# Altium schematic sheet IQDemod.SchDoc: Top Level
size 431 x 279 mm; Author: Kevin Heyer; DrawnBy: Kevin Heyer; Organization: ORGANIZATION; Address1: 207; Address2: 13399 104 Ave; Address3: Surrey BC, V3T 0C9; Address4: Canada; Revision: V0.0.0; SheetNumber: 1; SheetTotal: 2; Project: IQ Demod; ENG_APP_DATE: --/--/--; DSN_APP_DATE: --/--/--; CHK_APP_DATE: --/--/--
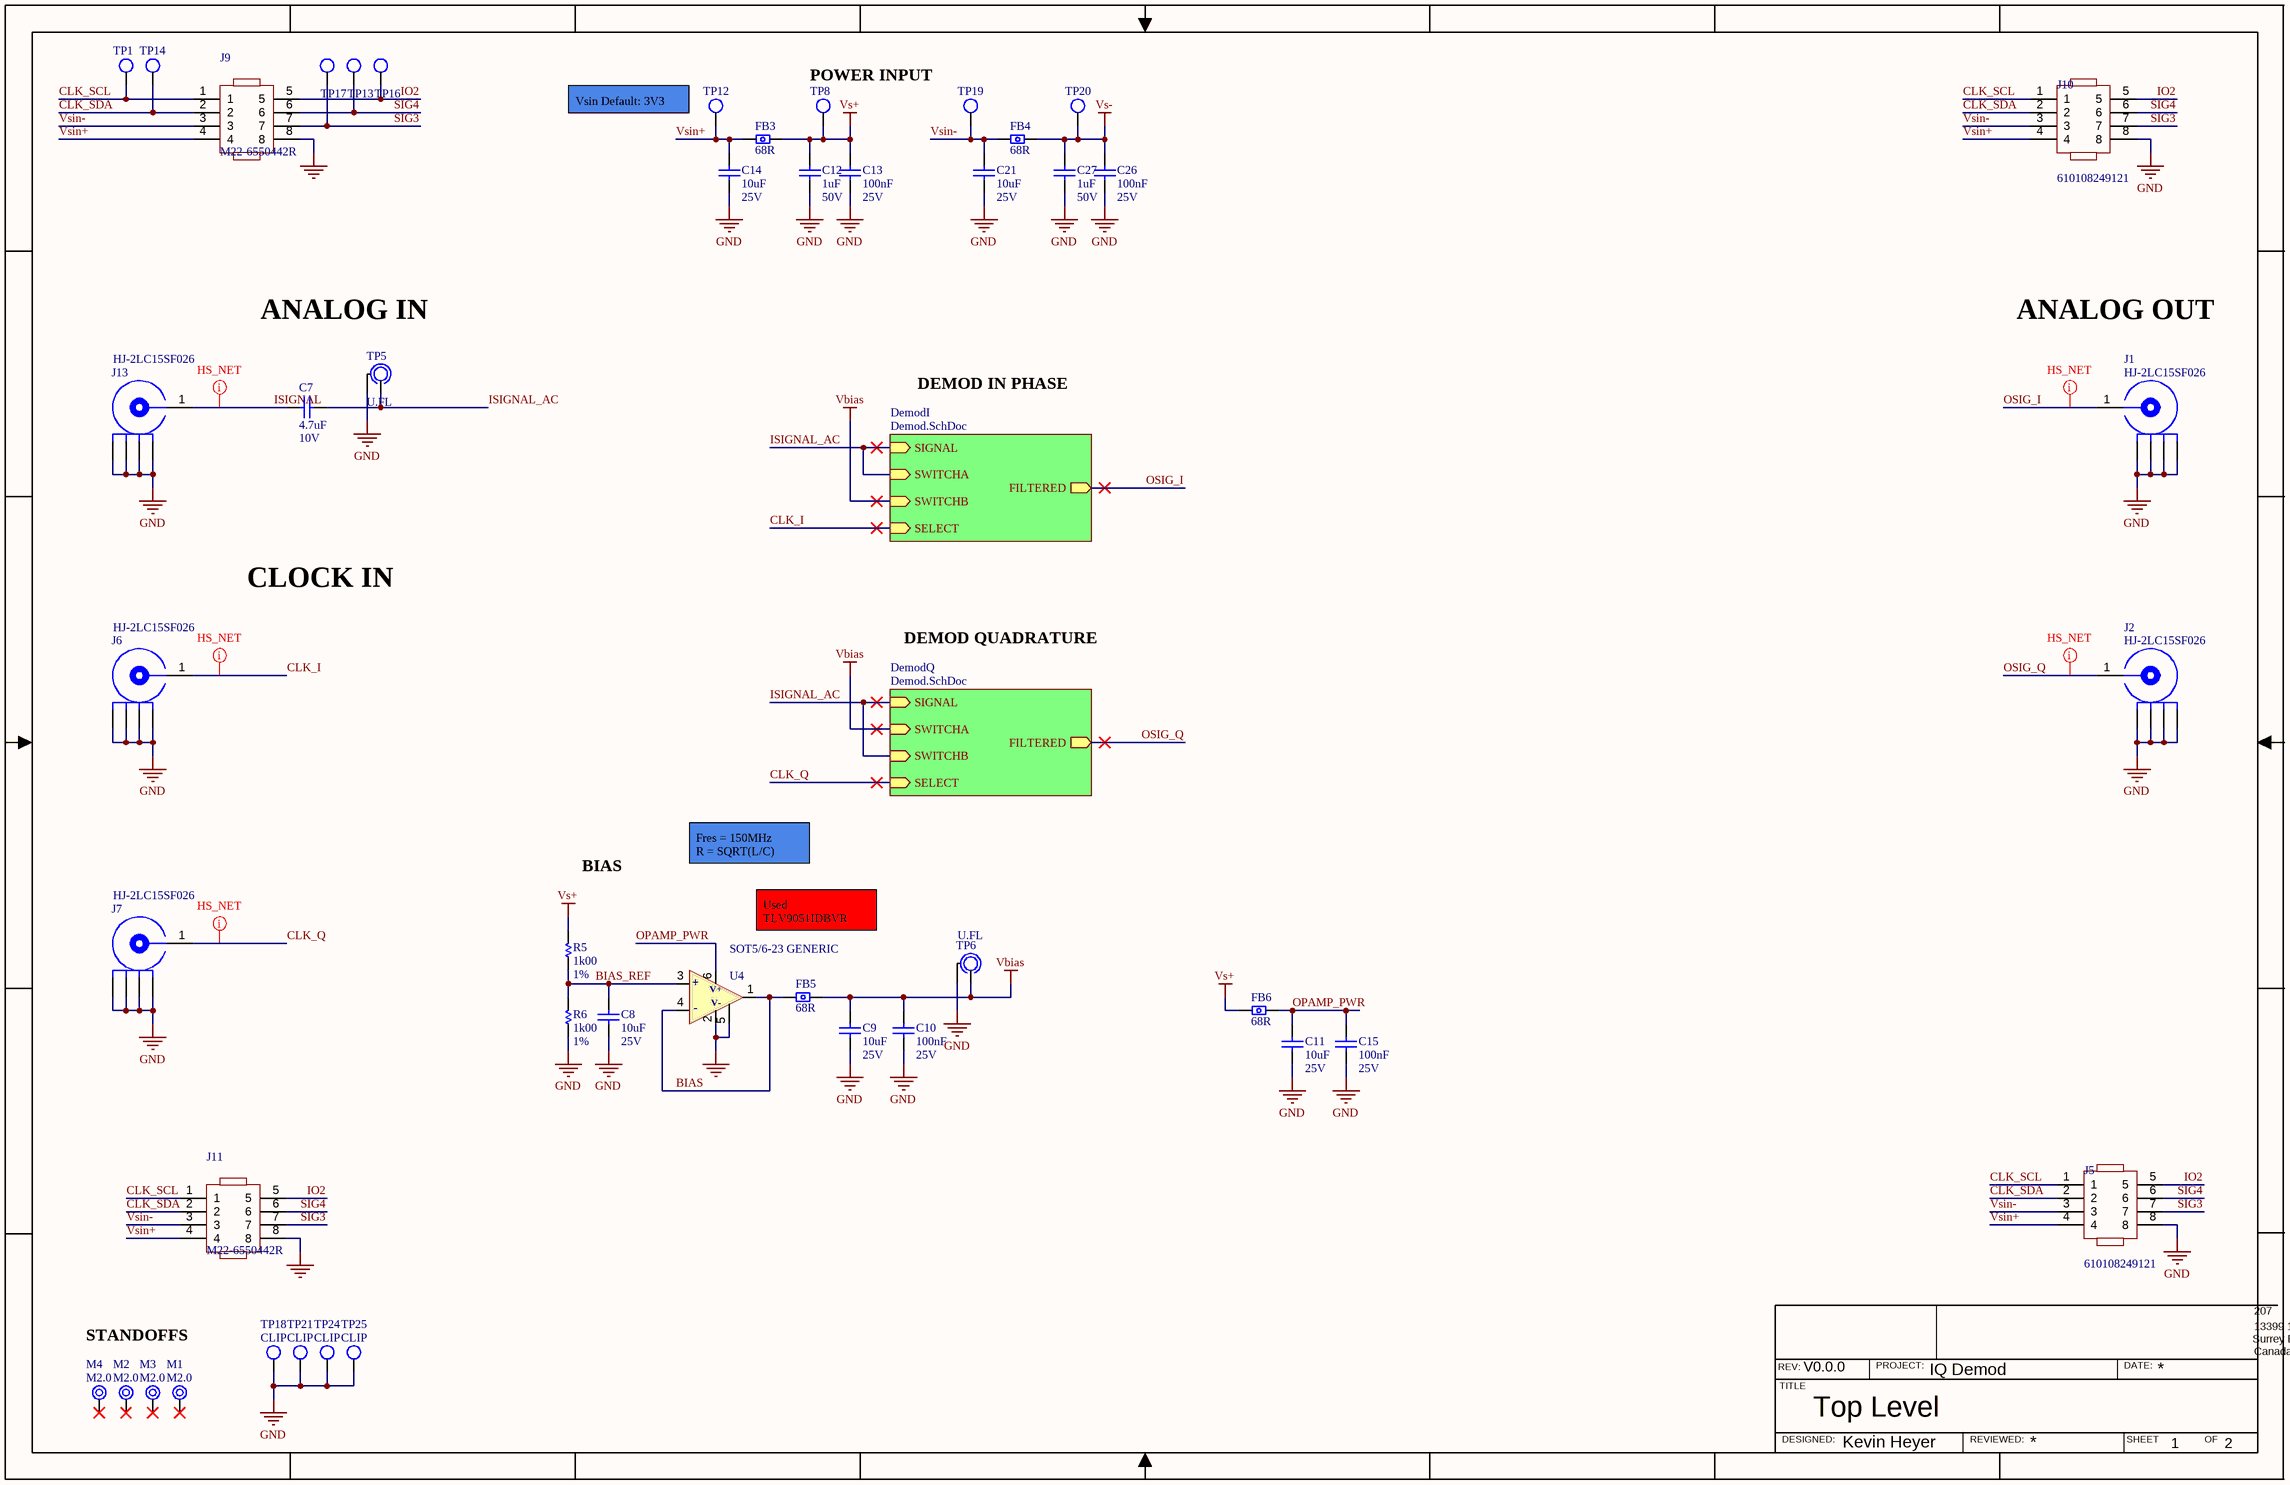
[diagram p0: IQDemod.SchDoc]

## Parts
C7  4.7uF  Voltage Rating: 10V  [C0402]
C8  10uF  Voltage Rating: 25V  [c0805]
C9  10uF  Voltage Rating: 25V  [c0805]
C10  100nF  Voltage Rating: 25V  [C0402]
C11  10uF  Voltage Rating: 25V  [c0805]
C12  1uF  Voltage Rating: 50V  [c0603]
C13  100nF  Voltage Rating: 25V  [C0402]
C14  10uF  Voltage Rating: 25V  [c0805]
C15  100nF  Voltage Rating: 25V  [C0402]
C21  10uF  Voltage Rating: 25V  [c0805]
C26  100nF  Voltage Rating: 25V  [C0402]
C27  1uF  Voltage Rating: 50V  [c0603]
FB3  68R  [FB0402]
FB4  68R  [FB0402]
FB5  68R  [FB0402]
FB6  68R  [FB0402]
J1  HJ-2LC15SF026  [SMA TH BORE]
J2  HJ-2LC15SF026  [SMA TH BORE]
J5  610108249121  [CONN HDR 08 MALE RA 2ROW - duplicate]
J6  HJ-2LC15SF026  [SMA TH BORE]
J7  HJ-2LC15SF026  [SMA TH BORE]
J9  M22-6550442R  [CONN HDR 08 FEMALE RA 2ROW]
J10  610108249121  [CONN HDR 08 MALE RA 2ROW - duplicate]
J11  M22-6550442R  [CONN HDR 08 FEMALE RA 2ROW]
J13  HJ-2LC15SF026  [SMA TH BORE]
M1  M2.0  [MECH M2.0 UNPLATED]  (no BOM)
M2  M2.0  [MECH M2.0 UNPLATED]  (no BOM)
M3  M2.0  [MECH M2.0 UNPLATED]  (no BOM)
M4  M2.0  [MECH M2.0 UNPLATED]  (no BOM)
R5  1k00  Tolerance: 1%  [R0402]
R6  1k00  Tolerance: 1%  [R0402]
TP1  1mm  [TESTPOINT_SMT]  (value not drawn)  (no BOM)
TP5  U.FL  [U.FL]
TP6  U.FL  [U.FL]
TP8  1mm  [TESTPOINT_SMT]  (value not drawn)  (no BOM)
TP12  1mm  [TESTPOINT_SMT]  (value not drawn)  (no BOM)
TP13  1mm  [TESTPOINT_SMT]  (value not drawn)  (no BOM)
TP14  1mm  [TESTPOINT_SMT]  (value not drawn)  (no BOM)
TP16  1mm  [TESTPOINT_SMT]  (value not drawn)  (no BOM)
TP17  1mm  [TESTPOINT_SMT]  (value not drawn)  (no BOM)
TP18  CLIP  [TESTPOINT_CLIP_1206]
TP19  1mm  [TESTPOINT_SMT]  (value not drawn)  (no BOM)
TP20  1mm  [TESTPOINT_SMT]  (value not drawn)  (no BOM)
TP21  CLIP  [TESTPOINT_CLIP_1206]
TP24  CLIP  [TESTPOINT_CLIP_1206]
TP25  CLIP  [TESTPOINT_CLIP_1206]
U4  SOT5/6-23 GENERIC  [SOT23-5/6_Modified]

## Sub-sheets
DemodI = Demod.SchDoc: SIGNAL (in), SWITCHA (in), SWITCHB (in), FILTERED (out), SELECT (in)
DemodQ = Demod.SchDoc: SIGNAL (in), SWITCHA (in), SWITCHB (in), FILTERED (out), SELECT (in)

## Nets
GND: C8.1 C9.1 C10.2 C11.1 C12.1 C13.1 C14.1 C15.2 C21.1 C26.1 C27.1 J1.0 J2.0 J5.8 J6.0 J7.0 J9.8 J10.8 J11.8 J13.0 R6.1 TP5.0 TP6.0 TP18.1 TP21.1 TP24.1 TP25.1 U4.2(V-) U4.5
Vbias: C9.2 C10.1 FB5.1 TP6.1 ; sheet DemodI/SWITCHB, sheet DemodQ/SWITCHA
Vs+: C12.2 C13.2 FB3.1 FB6.2 R5.2 TP8.1
Vs-: C26.2 C27.2 FB4.1 TP20.1
BIAS: FB5.2 U4.1 U4.4(-)
BIAS_REF: C8.2 R5.1 R6.2 U4.3(+)
CLK_I: J6.1 ; sheet DemodI/SELECT
CLK_Q: J7.1 ; sheet DemodQ/SELECT
CLK_SCL: J5.1 J9.1 J10.1 J11.1 TP1.1
CLK_SDA: J5.2 J9.2 J10.2 J11.2 TP14.1
IO2: J5.5 J9.5 J10.5 J11.5 TP16.1
ISIGNAL: C7.1 J13.1
ISIGNAL_AC: C7.2 TP5.1 ; sheet DemodI/SIGNAL, sheet DemodI/SWITCHA, sheet DemodQ/SIGNAL, sheet DemodQ/SWITCHB
OPAMP_PWR: C11.2 C15.1 FB6.1 U4.6(V+)
OSIG_I: J1.1 ; sheet DemodI/FILTERED
OSIG_Q: J2.1 ; sheet DemodQ/FILTERED
SIG3: J5.7 J9.7 J10.7 J11.7 TP17.1
SIG4: J5.6 J9.6 J10.6 J11.6 TP13.1
Vsin+: C14.2 FB3.2 J5.4 J9.4 J10.4 J11.4 TP12.1
Vsin-: C21.2 FB4.2 J5.3 J9.3 J10.3 J11.3 TP19.1

Not connected (* = marked no-connect by the designer): M1 1*; M2 1*; M3 1*; M4 1*

## Layout directives
net class HS_NET; rule Clearance Constraint [Generic clearance = 10mil, and 30 value(s) for objects]; rule Impedance Constraint [Min = 42.50    Max = 57.50    ]: CLK_I, CLK_Q, ISIGNAL, OSIG_I, OSIG_Q

## Notes on the sheet
- (near TP8) POWER INPUT
- (near TP12) Vsin Default: 3V3
- ANALOG IN
- ANALOG OUT
- DEMOD IN PHASE
- CLOCK IN
- DEMOD QUADRATURE
- BIAS
- Fres = 150MHz
  R = SQRT(L/C)
- Used TLV9051IDBVR
- STANDOFFS
- REV:
- PROJECT:
- DATE:
- TITLE
- SHEET
- OF
- DESIGNED:
- REVIEWED:

## Library data of the parts
C7 = CAP CER 4.7uF 10V X5R 0402: 0402 10 V 4.7 uF ±20% Tolerance X5R Multilayer Ceramic Chip Capacitor; Manufacturer: Murata; Manufacturer Part Number: GRM155R61A475MEAAD; Supplier 1: Newark; RoHS: Yes; Category: Ceramic Capacitors; Stock 1: 280000; Pricing 1: 1=0.02400, 10000=0.02400, 20000=0.02300, 40000=0.02100, 60000=0.02000 (USD); Mount: Surface Mount; Case/Package: 0402; Case Code (Imperial): 0402; Case Code (Metric): 1005; Min Operating Temperature: -55°C; Max Operating Temperature: 85°C; Packaging: Tape and Reel; Capacitance: 4.7uF; Tolerance: 20%; RoHS Compliant: Yes; ComponentLink1URL: http://www.farnell.com/datasheets/2189109.pdf?src-supplier=Farnell; ComponentLink1Description: http://www.farnell.com/datasheets/2189109.pdf?src-supplier=Farnell; ComponentLink2URL: http://www.farnell.com/datasheets/2189109.pdf?src-supplier=Newark; ComponentLink2Description: http://www.farnell.com/datasheets/2189109.pdf?src-supplier=Newark; ComponentLink3URL: http://www.farnell.com/datasheets/2189109.pdf?src-supplier=Element14; ComponentLink3Description: http://www.farnell.com/datasheets/2189109.pdf?src-supplier=Element14; ComponentLink4URL: https://search.murata.co.jp/Ceramy/image/img/A01X/G101/ENG/GRM155R61A475MEAA-01.pdf?src-supplier=Digi-Key; ComponentLink4Description: https://search.murata.co.jp/Ceramy/image/img/A01X/G101/ENG/GRM155R61A475MEAA-01.pdf?src-supplier=Digi-Key; Supplier Part Number 1: 92AH5018
C8 C9 C11 C14 C21 = CAP CER 10uF 25V X5R 0805: Cap Ceramic 10uF 25V X5R 10% SMD 0805 85°C Embossed T/R; Manufacturer: Samsung; Manufacturer Part Number: CL21A106KAYNNNE; Supplier 1: Digi-Key; RoHS: Yes; Category: Ceramic Capacitors; Stock 1: 2266338; Pricing 1: 2000=0.03549, 4000=0.03247 (USD); Mount: Surface Mount; Case/Package: 0805; Case Code (Metric): 2012; Case Code (Imperial): 0805; Min Operating Temperature: -55°C; Max Operating Temperature: 85°C; Package Quantity: 1; Packaging: Tape and Reel; Capacitance: 10uF; Tolerance: 10%; Dielectric: X5R; Series: CL; Construction: Flat; Length: 2mm; Width: 0.049inch; Height: 1.25mm; Depth: 1.25mm; Thickness: 0.057inch; Radiation Hardening: No; RoHS Compliant: Yes; ComponentLink1URL: https://datasheet.ciiva.com/25796/cl21a106kaynnne-25796720.pdf?src-supplier=Digi-Key; ComponentLink1Description: https://datasheet.ciiva.com/25796/cl21a106kaynnne-25796720.pdf?src-supplier=Digi-Key; ComponentLink2URL: https://datasheet.ciiva.com/26838/getdatasheetpartid-357558-26838583.pdf?src-supplier=Verical; ComponentLink2Description: https://datasheet.ciiva.com/26838/getdatasheetpartid-357558-26838583.pdf?src-supplier=Verical; Supplier Part Number 1: 1276-2891-2-ND
C10 C13 C15 C26 = CAP CER 100nF 25V X5R 0402: Cap Ceramic 0.1uF 25V X5R 10% Pad SMD 0402 85¡ãC T/R / Multi Layer Ceramic Capacitor (MLCC); Manufacturer: Samsung; Manufacturer Part Number: CL05A104KA5NNNC; Supplier 1: Digi-Key; RoHS: Yes; Category: Ceramic Capacitors; Stock 1: 8053194; Pricing 1: 1=0.10000, 10=0.01100, 50=0.00600, 100=0.00490, 500=0.00346, 1000=0.00272, 2500=0.00248, 5000=0.00228 (USD); Mount: Surface Mount; Case/Package: 0402; Case Code (Metric): 1005; Case Code (Imperial): 0402; Min Operating Temperature: -55°C; Max Operating Temperature: 85°C; Capacitance: 100nF; Tolerance: 10%; Dielectric: X5R; Packaging: Tape and Reel; Package Quantity: 1; Voltage: 25V; Series: CL; Construction: Flat; Voltage Rating (DC): 25V; Length: 1mm; Width: 0.02inch; Height: 0.5mm; Thickness: 0.022inch; Depth: 0.5mm; Radiation Hardening: No; Lead Free: Lead Free; ComponentLink1URL: https://datasheet.ciiva.com/25802/cl05a104ka5nnnc-25802704.pdf?src-supplier=Digi-Key; ComponentLink1Description: https://datasheet.ciiva.com/25802/cl05a104ka5nnnc-25802704.pdf?src-supplier=Digi-Key; ComponentLink2URL: https://datasheet.ciiva.com/26838/getdatasheetpartid-357412-26838142.pdf?src-supplier=Verical; ComponentLink2Description: https://datasheet.ciiva.com/26838/getdatasheetpartid-357412-26838142.pdf?src-supplier=Verical; ComponentLink3URL: https://datasheet.ciiva.com/16437/cl05a104ka5nnnc-16437369.pdf?src-supplier=Future+Electronics; ComponentLink3Description: https://datasheet.ciiva.com/16437/cl05a104ka5nnnc-16437369.pdf?src-supplier=Future+Electronics; ComponentLink4URL: https://datasheet.ciiva.com/26309/mlcc-catalogdownload2013-eng-26309014.pdf?src-supplier=Distrelec; ComponentLink4Description: https://datasheet.ciiva.com/26309/mlcc-catalogdownload2013-eng-26309014.pdf?src-supplier=Distrelec; Supplier Part Number 1: 1276-1043-1-ND
C12 C27 = CAP CER 1uF 50V X5R 0603: Multilayer Ceramic Capacitors (High dielectric type), 50V, 1 uF, ± 10 %, 0603, X5R, RoHS; Manufacturer: Taiyo Yuden; Manufacturer Part Number: UMK107BJ105KA-T; Tolerance: 10%; Supplier 1: Digi-Key; RoHS: Yes; Category: Ceramic Capacitors; Stock 1: 955108; Pricing 1: 1=0.19000, 10=0.12900, 50=0.07760, 100=0.06560, 500=0.04484, 1000=0.03968 (USD); Mount: Surface Mount; Case/Package: 0603; Number of Pins: 2; Case Code (Metric): 1608; Case Code (Imperial): 0603; Contact Plating: Nickel; Min Operating Temperature: -55°C; Max Operating Temperature: 85°C; Capacitance: 1uF; Packaging: Tape and Reel; Package Quantity: 1; Dielectric: X5R; Voltage Rating (DC): 50V; Termination: SMD/SMT; Series: M; Construction: Flat; Length: 1.6mm; Width: 0.031inch; Height: 0.8mm; Depth: 0.8mm; Thickness: 0.035inch; Radiation Hardening: No; RoHS Compliant: Yes; REACH SVHC: Unknown; Halogen Free: Halogen Free; ComponentLink1URL: https://datasheet.ciiva.com/134/umk107bj105ka-t-ss-134740.pdf?src-supplier=Digi-Key; ComponentLink1Description: https://datasheet.ciiva.com/134/umk107bj105ka-t-ss-134740.pdf?src-supplier=Digi-Key; ComponentLink2URL: https://datasheet.ciiva.com/11601/umk107bj105ka-t-ss-11601811.pdf?src-supplier=Avnet; ComponentLink2Description: https://datasheet.ciiva.com/11601/umk107bj105ka-t-ss-11601811.pdf?src-supplier=Avnet; ComponentLink3URL: https://datasheet.ciiva.com/5744/1697715-5744913.pdf?src-supplier=Farnell; ComponentLink3Description: https://datasheet.ciiva.com/5744/1697715-5744913.pdf?src-supplier=Farnell; ComponentLink4URL: https://datasheet.ciiva.com/30199/43umk107bj105ka-t-30199791.pdf?src-supplier=Onlinecomponents.com; ComponentLink4Description: https://datasheet.ciiva.com/30199/43umk107bj105ka-t-30199791.pdf?src-supplier=Onlinecomponents.com; ComponentLink5URL: https://datasheet.ciiva.com/15922/336umk107bj105ka-t-15922611.pdf?src-supplier=Onlinecomponents.com; ComponentLink5Description: https://datasheet.ciiva.com/15922/336umk107bj105ka-t-15922611.pdf?src-supplier=Onlinecomponents.com; ComponentLink6URL: https://datasheet.ciiva.com/5427/mlcc-all-e-541559-5427036.pdf?src-supplier=Mouser; ComponentLink6Description: https://datasheet.ciiva.com/5427/mlcc-all-e-541559-5427036.pdf?src-supplier=Mouser; ComponentLink7URL: https://datasheet.ciiva.com/7975/mlcc-all-e-7975898.pdf?src-supplier=Element14; ComponentLink7Description: https://datasheet.ciiva.com/7975/mlcc-all-e-7975898.pdf?src-supplier=Element14; ComponentLink8URL: https://datasheet.ciiva.com/7975/1697715-7975608.pdf?src-supplier=Element14; ComponentLink8Description: https://datasheet.ciiva.com/7975/1697715-7975608.pdf?src-supplier=Element14; ComponentLink9URL: https://datasheet.ciiva.com/22694/1697715-22694278.pdf?src-supplier=Element14; ComponentLink9Description: https://datasheet.ciiva.com/22694/1697715-22694278.pdf?src-supplier=Element14; Supplier Part Number 1: 587-2400-1-ND
FB3-FB6 = FB 68R 400mA 310mR 0402: Ferrite Beads Multi-Layer 68Ohm 25% 100MHz 400mA 310mOhm DCR 0402 T/R; Manufacturer: Taiyo Yuden; Manufacturer Part Number: BK1005LL680-T; DC Resistance (DCR): 310mR; Number of Lines: 1; Shielding: Unshielded; Supplier 1: Digi-Key; RoHS: Yes; Category: Ferrite Beads and Chips; Stock 1: 9707; Pricing 1: 1=0.10000, 10=0.04100, 25=0.03640, 50=0.03300, 100=0.02970, 250=0.02176, 500=0.01584, 1000=0.01551, 5000=0.01056 (USD); Mount: Surface Mount; Case/Package: 0402; Number of Pins: 2; Case Code (Metric): 1005; Case Code (Imperial): 0402; Core Material: Ferrite; Min Operating Temperature: -55°C; Max Operating Temperature: 125°C; Packaging: Tape and Reel; Package Quantity: 1; Impedance: 68R; Tolerance: 25%; Max DC Current: 400mA; Termination: SMD/SMT; Test Frequency: 100MHz; Max Current Rating: 400mA; Series: BK; Frequency: 100MHz; Length: 0.039inch; Width: 0.02inch; Height: 0.022inch; Depth: 0.55mm; Halogen Free: Halogen Free; Lead Free: Lead Free; REACH SVHC: Unknown; ComponentLink1URL: https://datasheet.ciiva.com/1013/bk1005ll680-t-ss-1013936.pdf?src-supplier=Digi-Key; ComponentLink1Description: https://datasheet.ciiva.com/1013/bk1005ll680-t-ss-1013936.pdf?src-supplier=Digi-Key; ComponentLink2URL: https://datasheet.ciiva.com/1013/mlci07-e-1013935.pdf?src-supplier=Digi-Key; ComponentLink2Description: https://datasheet.ciiva.com/1013/mlci07-e-1013935.pdf?src-supplier=Digi-Key; ComponentLink3URL: https://datasheet.ciiva.com/1013/mlci07-e-1013937.pdf?src-supplier=Digi-Key; ComponentLink3Description: https://datasheet.ciiva.com/1013/mlci07-e-1013937.pdf?src-supplier=Digi-Key; Supplier Part Number 1: 587-1860-1-ND
J1 J2 J6 J7 J13 = CON SMA BORE TH HJ-SMA058
J5 J10 = CONN HDR 08 MALE RA 2 ROW: SMT Angled Pin Header WR-PHD, Pitch 2.54 mm, Dual Row, 8 pins; Manufacturer: Wurth Electronics; Number of Positions: 8; Current Rating: 3A; Gender: Male; Voltage Rating: 250V; Pitch: 0.1inch; Supplier 1: Newark; Manufacturer Part Number: 610108249121; RoHS: Yes; Category: Connectors; Stock 1: 350; Pricing 1: 1=1.53000, 10=1.52000, 25=1.49000, 50=1.46000, 100=1.36000 (USD); Mount: Surface Mount; Contact Plating: Gold; Contact Material: Copper Alloy; Insulation Color: Black; Insulation Material: Nylon; Contact Shape: Square; Connector Type: Header; Fastening Type: Pull; Packaging: Cut Tape; Number of Rows: 2; Termination: Solder; Flammability Rating: UL94 V-0; RoHS Compliant: Yes; ComponentLink1URL: http://www.farnell.com/cad/1889791.pdf?src-supplier=Element14; ComponentLink1Description: http://www.farnell.com/cad/1889791.pdf?src-supplier=Element14; Supplier Part Number 1: 72Y1215; Number of Pins: 8; Color: Black; Contact Finish - Mating: GOLD; Number of Contacts: 8; Series: WR-PHD; Contact Type: Male Pin; Row Spacing: 0.1inch; Contact Mating Length: 0.236inch; ComponentLink2URL: https://katalog.we-online.de/em/datasheet/6101xx249121.pdf?src-supplier=Digi-Key; ComponentLink2Description: https://katalog.we-online.de/em/datasheet/6101xx249121.pdf?src-supplier=Digi-Key; ComponentLink3URL: https://www.distrelec.bizhttp://katalog.we-online.de/em/datasheet/6101xx249121.pdf?mime=application%2Fpdf&src-supplier=Distrelec; ComponentLink3Description: https://www.distrelec.bizhttp://katalog.we-online.de/em/datasheet/6101xx249121.pdf?mime=application%2Fpdf&src-supplier=Distrelec
J9 J11 = CONN HDR 08 FEMALE RA 2 ROW: Conn Socket Strip RCP 8 POS 2mm Solder RA SMD T/R; Manufacturer: Harwin; Current Rating: 2A; Number of Positions: 8; Connector Type: Receptacle,Forked; Supplier 1: Newark; Manufacturer Part Number: M22-6550442R; RoHS: Yes; Category: Connectors; Stock 1: 750; Pricing 1: 1=1.17000, 100=0.91900, 250=0.84000, 500=0.76600, 1000=0.71200 (USD); Mount: Surface Mount; Contact Material: Bronze; Contact Plating: Gold; Contact Shape: Square; Insulation Material: Polymer; Insulation Color: Black; Packaging: Cut Tape; Number of Rows: 2; Termination: Solder; Fastening Type: Push,Pull; RoHS Compliant: Yes; Flammability Rating: UL94 V-0; ComponentLink1URL: https://cdn.harwin.com/pdfs/M22-655R.pdf?src-supplier=Digi-Key; ComponentLink1Description: https://cdn.harwin.com/pdfs/M22-655R.pdf?src-supplier=Digi-Key; Supplier Part Number 1: 45AJ6425; Min Operating Temperature: -40°C; Max Operating Temperature: 105°C
M1-M4 = MECH M2.0 UNPLATED
R5 R6 = RES 1k00 63mW 0402: 1 kOhms ¡À1% 0.063W, 1/16W Chip Resistor 0402 (1005 Metric) Moisture Resistant Thick Film; Manufacturer: Yageo; Manufacturer Part Number: RC0402FR-071KL; Resistance: 1kR; Temperature Coefficient: 100ppm/°C; Power Rating: 62.5mW; Voltage Rating: 50V; Max Power Dissipation: 63mW; Supplier 1: Newark; RoHS: Yes; Category: Chip SMD Resistors; Stock 1: 3520000; Pricing 1: 1=0.00100, 10000=0.00100 (USD); Case/Package: 0402; Number of Pins: 2; Case Code (Imperial): 0402; Case Code (Metric): 1005; Size Code: 0402; Min Operating Temperature: -55°C; Max Operating Temperature: 155°C; Resistor Type: Thick Film; Packaging: Tape and Reel; Voltage Rating (DC): 50V; Termination: SMD/SMT; Features: Moisture Resistant; Series: RC; Number of Terminations: 2; Resistance Tolerance: 1%; Construction: Rectangular; Technology: THICK FILM; Length: 1mm; Width: 0.5mm; Height: 0.32mm; Depth: 0.5mm; RoHS Compliant: Yes; Reach SVHC Compliant: Yes; Military Standard: Not; Lead Free: Lead Free; ComponentLink1URL: https://datasheet.ciiva.com/11819/0900766b80c66297-11819477.pdf?src-supplier=RSComponents; ComponentLink1Description: https://datasheet.ciiva.com/11819/0900766b80c66297-11819477.pdf?src-supplier=RSComponents; ComponentLink2URL: https://datasheet.ciiva.com/7983/1018594-7983502.pdf?src-supplier=Element14; ComponentLink2Description: https://datasheet.ciiva.com/7983/1018594-7983502.pdf?src-supplier=Element14; ComponentLink3URL: https://datasheet.ciiva.com/22747/1018594-22747513.pdf?src-supplier=Element14; ComponentLink3Description: https://datasheet.ciiva.com/22747/1018594-22747513.pdf?src-supplier=Element14; ComponentLink4URL: https://datasheet.ciiva.com/12666/pyu-rc0402-51-rohs-l-6-r-12666741.pdf?src-supplier=Mouser; ComponentLink4Description: https://datasheet.ciiva.com/12666/pyu-rc0402-51-rohs-l-6-r-12666741.pdf?src-supplier=Mouser; ComponentLink5URL: https://datasheet.ciiva.com/7849/1018594-7849869.pdf?src-supplier=Element14; ComponentLink5Description: https://datasheet.ciiva.com/7849/1018594-7849869.pdf?src-supplier=Element14; ComponentLink6URL: https://datasheet.ciiva.com/7849/1018594-7849871.pdf?src-supplier=Element14; ComponentLink6Description: https://datasheet.ciiva.com/7849/1018594-7849871.pdf?src-supplier=Element14; ComponentLink7URL: https://datasheet.ciiva.com/17063/pyu-rc0402-51-rohs-l-6-r-17063193.pdf?src-supplier=Future+Electronics; ComponentLink7Description: https://datasheet.ciiva.com/17063/pyu-rc0402-51-rohs-l-6-r-17063193.pdf?src-supplier=Future+Electronics; Supplier Part Number 1: 48Y4534
TP1 TP8 TP12-TP14 TP16 TP17 TP19 TP20 = TP 1mm: SMT testpoint
TP5 TP6 = TP U.FL: CONN U.FL RCPT STR 50 OHM SMD; Manufacturer: Hirose; Manufacturer Part Number: U.FL-R-SMT-1(80); Body Material: Bronze; Body Plating: Silver; Center Contact Plating: Gold; Dielectric Material: Polymer; Connector Type: Receptacle,Male Pin; Impedance: 50R; Max Frequency: 6GHz; Number of Ports: 1; Mating Cycles: 30; Supplier 1: Future Electronics; RoHS: Yes; Category: RF / Coaxial Connectors; Stock 1: 40000; Pricing 1: 10000=0.81500, 20000=0.80000, 30000=0.78500 (USD); Mount: Surface Mount; Case/Package: SMD/SMT; Contact Material: Brass; Housing Color: Beige; Min Operating Temperature: -40°C; Max Operating Temperature: 90°C; Package Quantity: 10000; Packaging: Tape and Reel; Fastening Type: SNAP-ON; Series: U.FL; Termination: Solder; Lead Free: Lead Free; RoHS Compliant: Yes; ComponentLink1URL: http://www.mouser.com/ds/2/185/U.FL_catalog-939761.pdf?src-supplier=Mouser; ComponentLink1Description: http://www.mouser.com/ds/2/185/U.FL_catalog-939761.pdf?src-supplier=Mouser; ComponentLink2URL: https://www.hirose.com/product/en/download_file/key_name/U.FL-R-SMT-1%2880%29/category/Specification%20Sheet/doc_file_id/37638/?file_category_id=9&item_id=03310472280&is_series=&src-supplier=Digi-Key; ComponentLink2Description: https://www.hirose.com/product/en/download_file/key_name/U.FL-R-SMT-1%2880%29/category/Specification%20Sheet/doc_file_id/37638/?file_category_id=9&item_id=03310472280&is_series=&src-supplier=Digi-Key
TP18 TP21 TP24 TP25 = TP CLIP 1206 RCWCTE: Current Sense Resistors - SMD CHIP CHECKER HT=2.0 1206; Manufacturer: KOA Speer; Manufacturer Part Number: RCWCTE; Resistance: 0R; Current Rating: 2A; Supplier 1: Digi-Key; RoHS: Yes; Category: Chip SMD Resistors; Stock 1: 282207; Pricing 1: 1=0.16000, 10=0.13700, 25=0.12120, 50=0.11320, 100=0.10500, 250=0.09292, 500=0.08888, 1000=0.07272 (USD); Mount: Surface Mount; Case/Package: 1206; Case Code (Imperial): 1206; Case Code (Metric): 3216; Min Operating Temperature: -55°C; Max Operating Temperature: 125°C; Packaging: Tape and Reel; Termination: SMD/SMT; Series: RC; Length: 3.2mm; Width: 1.6mm; Height: 2mm; Depth: 1.6mm; Military Standard: Not; RoHS Compliant: Yes; ComponentLink1URL: https://datasheet.ciiva.com/34302/1876186-34302940.pdf?src-supplier=Jameco; ComponentLink1Description: https://datasheet.ciiva.com/34302/1876186-34302940.pdf?src-supplier=Jameco; ComponentLink2URL: https://datasheet.ciiva.com/5556/rc-5556236.pdf?src-supplier=Mouser; ComponentLink2Description: https://datasheet.ciiva.com/5556/rc-5556236.pdf?src-supplier=Mouser; ComponentLink3URL: https://datasheet.ciiva.com/26821/getdatasheetpartid-110197-26821157.pdf?src-supplier=Verical; ComponentLink3Description: https://datasheet.ciiva.com/26821/getdatasheetpartid-110197-26821157.pdf?src-supplier=Verical; Supplier Part Number 1: 2019-RCWCTECT-ND
U4 = IC OPAMP SOT5/6-23 GENERIC: Number of Channels: 1; RoHS: Yes; Category: Amplifiers - Op Amps, Buffer, Instrumentation; Mount: Surface Mount; Case/Package: SOT; Number of Pins: 6; Number of Circuits: 1; RoHS Compliant: Yes